# EAGLE design highwind_beaglebone_cape_v2 (EAGLE 5.12)
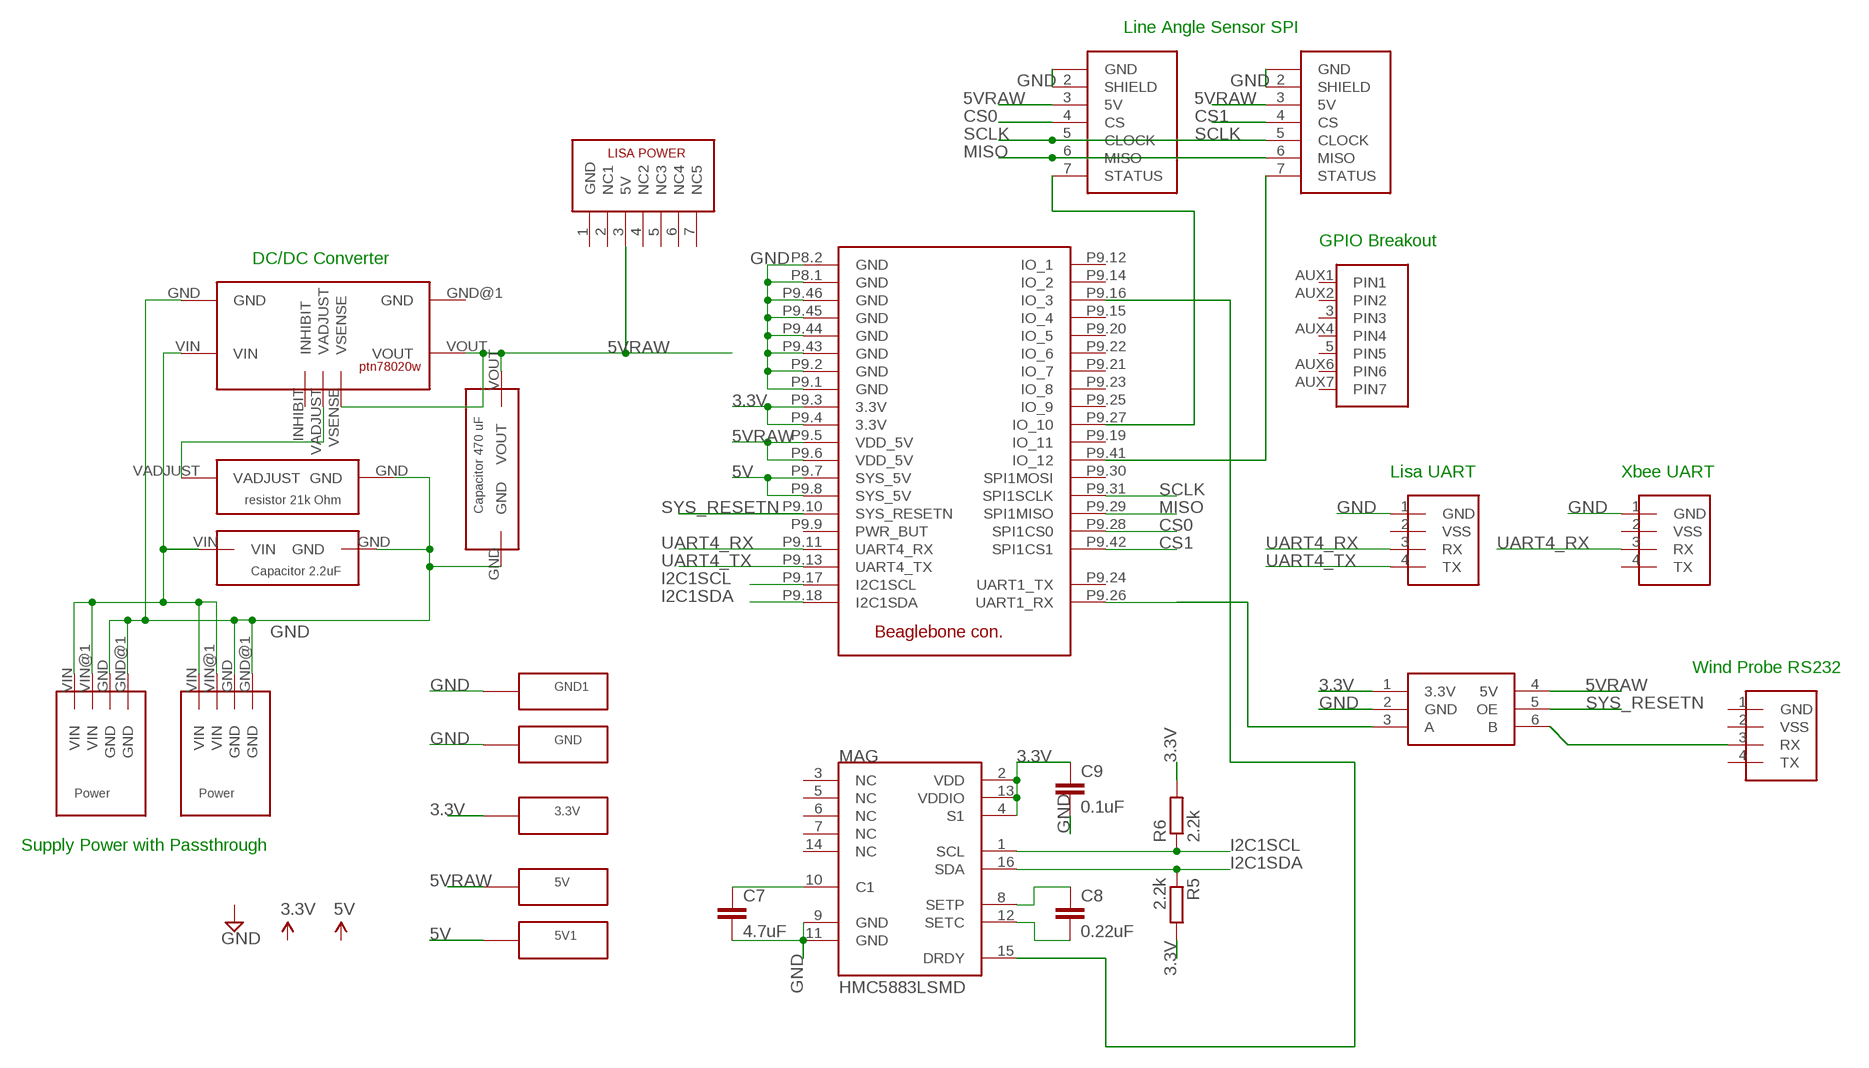
[diagram p0: schematic, sheet 1]

## Parts
3.3V  1PIN  [1PIN]
5V  1PIN  [1PIN]
5V1  1PIN  [1PIN]
AZIMUTH_ENCODER  LINEANGLE_SPI  [53047-07-STANDARD]
C7  4.7uF  C-EUC0805  [C0805]
C8  0.22uF  C-EUC0805  [C0805]
C9  0.1uF  C-EUC0805  [C0805]
DC-DC_CONVERTER  PTN78020W  [PTN78020W]
ELEVATION_ENCODER  LINEANGLE_SPI  [53047-07-STANDARD]
FOR_FUTURE_USE  HIGHWIND_GPIO  [53047-07-BREAKOUT]
GND  1PIN  [1PIN]
GND1  1PIN  [1PIN]
LEVEL_SHIFTER  TXS0101  [SOT23-6]
LISA_POWER  LISA_POWER  [53047-07-STANDARD]
LISA_UART  PICO4UART  [53047-04-STANDARD]
MAG  HMC5883LSMD  [16LPCC]
R5  2.2k  R-EU_R0805  [R0805]
R6  2.2k  R-EU_R0805  [R0805]
U$1  BEAGLEBONECONNECTOR  [BBONE_SHIELD_HEADER]
U$2  2.2F  [2.2?F]
U$4  21KOHM  [21KOHM]
U$5  470F  [470?F]
U$11  4PINPOWER  [4PINPOWER]
U$14  4PINPOWER  [4PINPOWER]
WIND  PICO4UART  [53047-04-STANDARD]
XBEE_UART  PICO4UART  [53047-04-STANDARD]

## Nets
3.3V: 3.3V.1(PINOUT) C9.1 LEVEL_SHIFTER.1(3.3V) MAG.2(VDD) MAG.4(S1) MAG.13(VDDIO) R5.2 R6.2 U$1.P9.3(3.3V) U$1.P9.4(3.3V)
5V: 5V1.1(PINOUT) U$1.P9.7(SYS_5V) U$1.P9.8(SYS_5V)
5VRAW: 5V.1(PINOUT) AZIMUTH_ENCODER.3(5V) DC-DC_CONVERTER.VOUT DC-DC_CONVERTER.VSENSE ELEVATION_ENCODER.3(5V) LEVEL_SHIFTER.4(5V) LISA_POWER.3(5V) U$1.P9.5(VDD_5V) U$1.P9.6(VDD_5V) U$5.VOUT
CS0: AZIMUTH_ENCODER.4(CS) U$1.P9.28(SPI1CS0)
CS1: ELEVATION_ENCODER.4(CS) U$1.P9.42(SPI1CS1)
GND: AZIMUTH_ENCODER.1(GND) AZIMUTH_ENCODER.2(SHIELD) C7.2 C9.2 DC-DC_CONVERTER.GND ELEVATION_ENCODER.1(GND) ELEVATION_ENCODER.2(SHIELD) GND1.1(PINOUT) GND.1(PINOUT) LEVEL_SHIFTER.2(GND) LISA_UART.1(GND) MAG.9(GND) MAG.11(GND) U$1.P8.1(GND) U$1.P8.2(GND) U$1.P9.1(GND) U$1.P9.2(GND) U$1.P9.43(GND) U$1.P9.44(GND) U$1.P9.45(GND) U$1.P9.46(GND) U$2.GND U$4.GND U$5.GND U$11.GND U$11.GND@1(GND) U$14.GND U$14.GND@1(GND) XBEE_UART.1(GND)
I2C1SCL: MAG.1(SCL) R6.1 U$1.P9.17(I2C1SCL)
I2C1SDA: MAG.16(SDA) R5.1 U$1.P9.18(I2C1SDA)
MISO: AZIMUTH_ENCODER.6(MISO) ELEVATION_ENCODER.6(MISO) U$1.P9.29(SPI1MISO)
N$1: LEVEL_SHIFTER.6(B) WIND.3(RX)
N$2: MAG.15(DRDY) U$1.P9.16(IO_3)
N$5: ELEVATION_ENCODER.7(STATUS) U$1.P9.41(IO_12)
N$6: AZIMUTH_ENCODER.7(STATUS) U$1.P9.27(IO_10)
N$13: C7.1 MAG.10(C1)
N$14: C8.1 MAG.8(SETP)
N$15: C8.2 MAG.12(SETC)
SCLK: AZIMUTH_ENCODER.5(CLOCK) ELEVATION_ENCODER.5(CLOCK) U$1.P9.31(SPI1SCLK)
SYS_RESETN: LEVEL_SHIFTER.5(OE) U$1.P9.10(SYS_RESETN)
UART1_RX: LEVEL_SHIFTER.3(A) U$1.P9.26(UART1_RX)
UART4_RX: LISA_UART.3(RX) U$1.P9.11(UART4_RX) XBEE_UART.3(RX)
UART4_TX: LISA_UART.4(TX) U$1.P9.13(UART4_TX)
VADJUST: DC-DC_CONVERTER.VADJUST U$4.VADJUST
VIN: DC-DC_CONVERTER.VIN U$2.VIN U$11.VIN U$11.VIN@1(VIN) U$14.VIN U$14.VIN@1(VIN)
Unconnected: FOR_FUTURE_USE.3(PIN3) FOR_FUTURE_USE.5(PIN5) FOR_FUTURE_USE.AUX1(PIN1) FOR_FUTURE_USE.AUX2(PIN2) FOR_FUTURE_USE.AUX4(PIN4) FOR_FUTURE_USE.AUX6(PIN6) FOR_FUTURE_USE.AUX7(PIN7) LISA_POWER.2(NC1) LISA_POWER.4(NC2) LISA_POWER.5(NC3) LISA_POWER.6(NC4) LISA_POWER.7(NC5) LISA_UART.2(VSS) MAG.3(NC) MAG.5(NC) MAG.6(NC) MAG.7(NC) MAG.14(NC) U$1.P9.9(PWR_BUT) U$1.P9.12(IO_1) U$1.P9.14(IO_2) U$1.P9.15(IO_4) U$1.P9.19(IO_11) U$1.P9.20(IO_5) U$1.P9.21(IO_7) U$1.P9.22(IO_6) U$1.P9.23(IO_8) U$1.P9.24(UART1_TX) U$1.P9.25(IO_9) U$1.P9.30(SPI1MOSI) WIND.2(VSS) WIND.4(TX) XBEE_UART.2(VSS) XBEE_UART.4(TX)

## Notes on the sheet
- Line Angle Sensor SPI
- GPIO Breakout
- DC/DC Converter
- Lisa UART | Xbee UART
- Wind Probe RS232
- Supply Power with Passthrough

## Power pins joined to a net without a drawn wire
GND: DC-DC_CONVERTER.GND@1(GND) LISA_POWER.1(GND) WIND.1(GND)
INHIBIT: DC-DC_CONVERTER.INHIBIT

## Library data of the parts
3.3V 5V 5V1 GND GND1 = Highwind:1PIN
AZIMUTH_ENCODER ELEVATION_ENCODER = Highwind:LINEANGLE_SPI
C7-C9 = resistor:C-EU: CAPACITOR, European symbol
DC-DC_CONVERTER = Highwind:PTN78020W
FOR_FUTURE_USE = Highwind:HIGHWIND_GPIO
LEVEL_SHIFTER = Highwind:TXS0101
LISA_POWER = Highwind:LISA_POWER
LISA_UART WIND XBEE_UART = Highwind:PICO4UART
MAG = SparkFun:HMC5883L: 3 Axis Digital Compass IC
R5 R6 = resistor:R-EU_: RESISTOR, European symbol
U$1 = Highwind:BEAGLEBONECONNECTOR
U$2 = Highwind:2.2?F
U$4 = Highwind:21KOHM
U$5 = Highwind:470?F
U$11 U$14 = Highwind:4PINPOWER

## Board
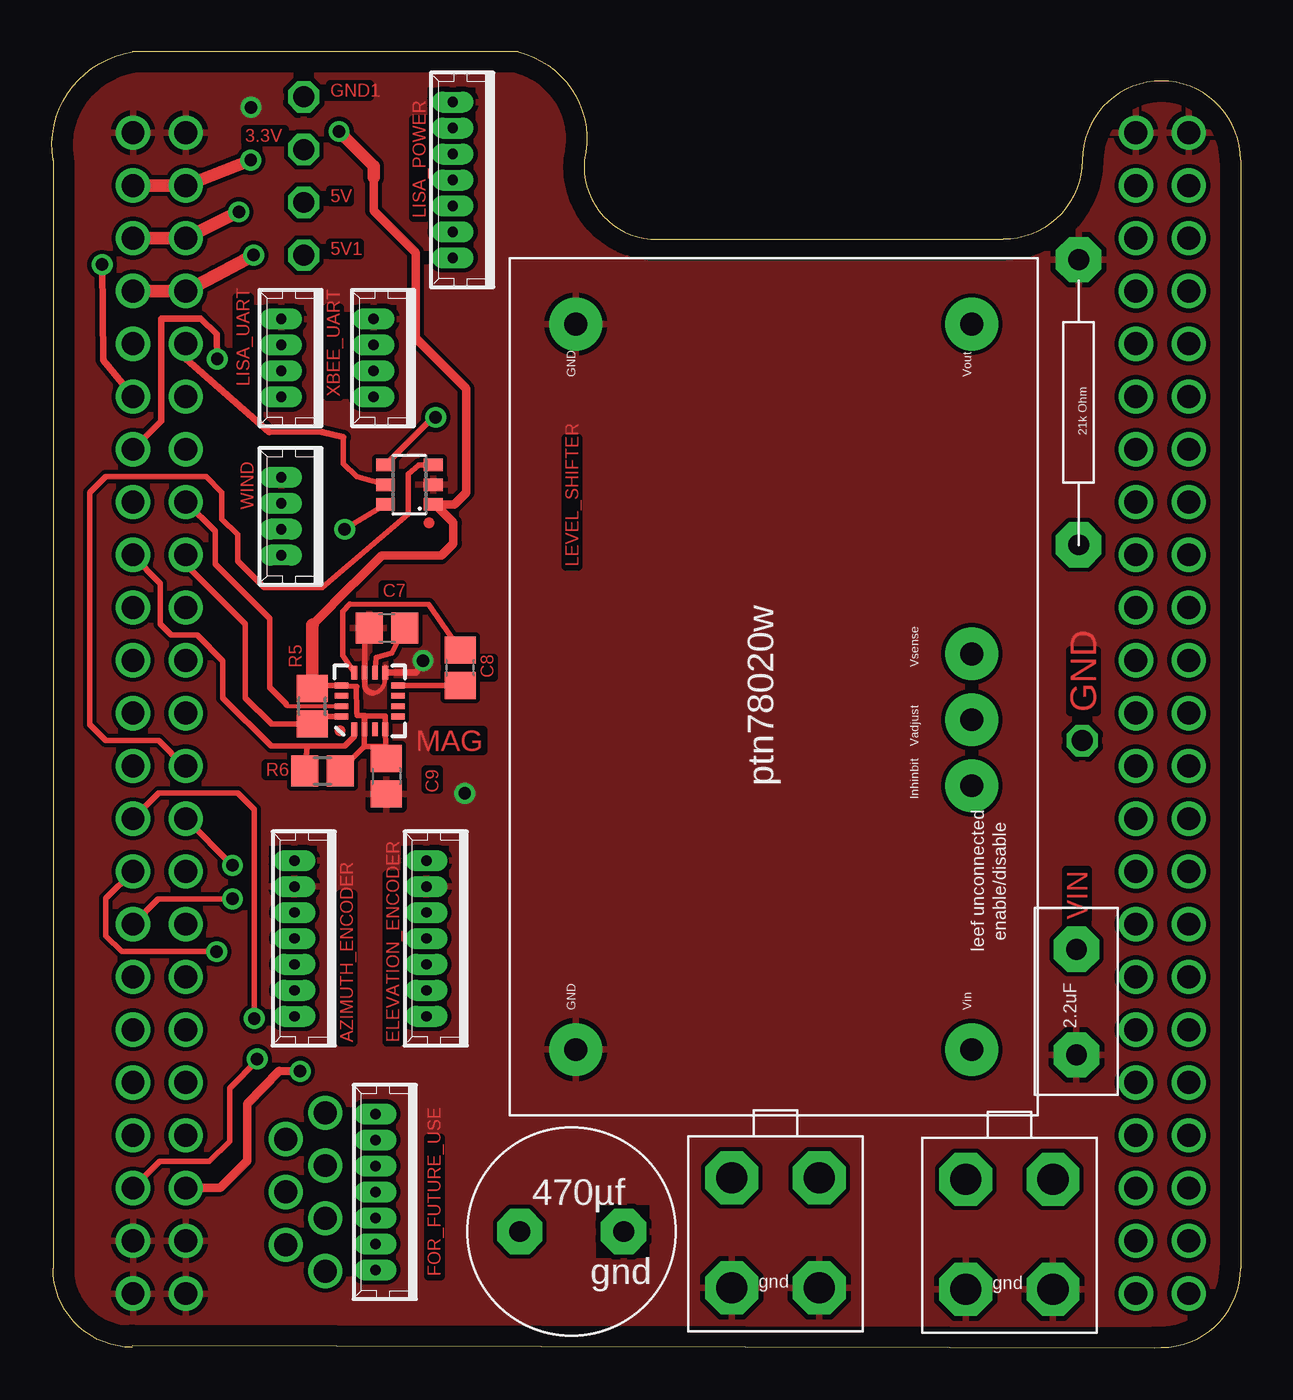
[diagram p1: board, top side]
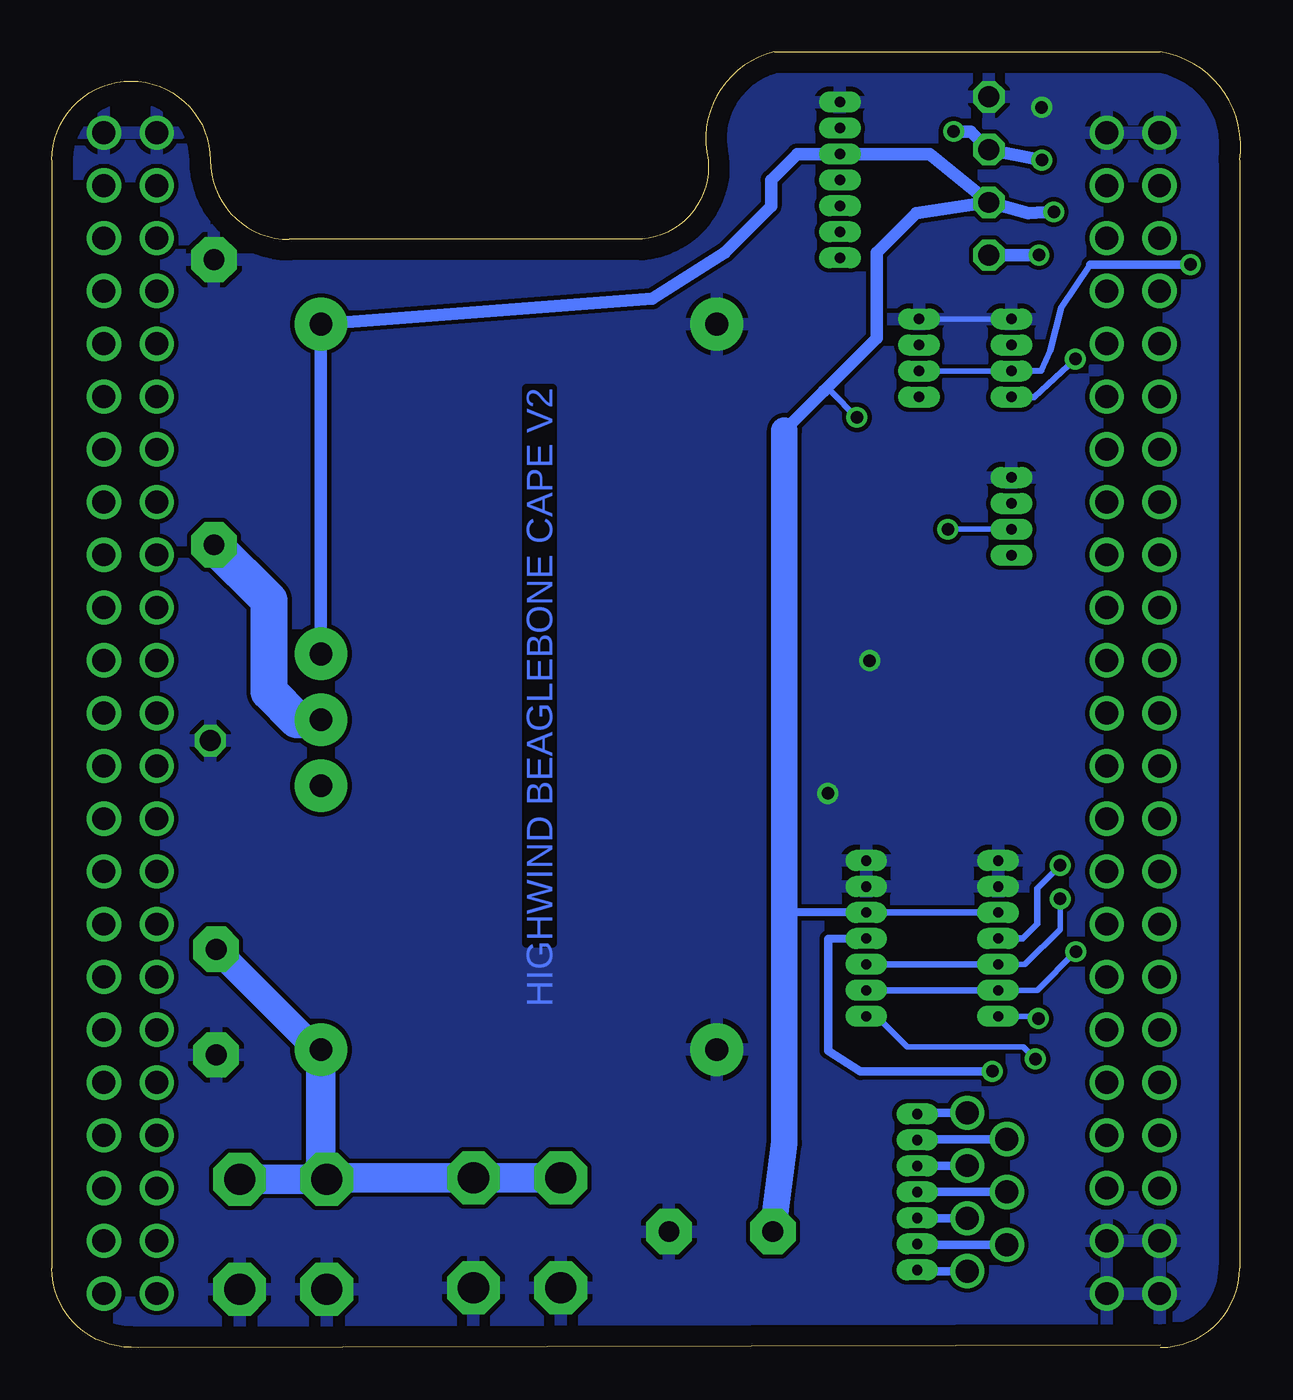
[diagram p2: board, bottom side, seen from below]

Size 57.2 x 62.37 mm. Coordinates in mm from the lower left corner, seen from the top.
Outline: 3.86,0.01 arc-90 0.05,3.82 0.05,57.16 arc-90 3.86,62.37 22.44,62.37 arc-90 25.62,57.16 arc90 28.81,53.35 45.77,53.35 arc90 49.58,57.16 arc-90 53.39,60.97 arc-90 57.2,57.16 57.2,3.82 arc-90 53.39,0.01 53.05,0 3.86,0.1
Copper layers (1*16): Top 0.035mm / dielectric 1.5mm / Bottom 0.035mm
Design rules "esat": minimum track width 10mil, minimum drill 24mil, track to track 8mil, track to pad 8mil, pad to pad 8mil, via to via 8mil, smd to smd 8mil, copper to edge 40mil, drill to drill 8mil, minimum pad ring 10mil, minimum via ring 8mil, stop-mask expansion 4mil, vias tented up to drill 0mil, thermal gap 10mil

### Footprints (pad centres in the part's own frame; a part is rotated, then mirrored left to right if it is on the bottom)
1PIN = drill 1 octagon: 1 0,0
53047-07-STANDARD = drill 0.5 pad 0.698 long: 1 3.75,0.45; 2 2.5,0.45; 3 1.25,0.45; 4 0,0.45; 5 -1.25,0.45; 6 -2.5,0.45; 7 -3.75,0.45
C0805 = smd 1.3 x 1.5: 1 -0.85,0; 2 0.85,0
PTN78020W = drill 1.1 pad 2.54 round: GND -15.875,19.05; GND@1 19.05,19.05; INHIBIT -3.175,0; VADJUST 0,0; VIN -15.875,0; VOUT 19.05,0; VSENSE 3.175,0
53047-07-BREAKOUT = drill 0.5 pad 0.698 long: 1 3.75,0.45; 2 2.5,0.45; 3 1.25,0.45; 4 0,0.45; 5 -1.25,0.45; 6 -2.5,0.45; 7 -3.75,0.45 | drill 1.1 round: AUX1 3.81,2.857; AUX2 2.54,4.763; AUX3 1.27,2.857; AUX4 0,4.763; AUX5 -1.27,2.857; AUX6 -2.54,4.763; AUX7 -3.81,2.857
SOT23-6 = smd 0.6 x 0.9: 1 -0.95,-1.15; 2 0,-1.15; 3 0.95,-1.15; 4 0.95,1.15; 5 0,1.15; 6 -0.95,1.15
53047-04-STANDARD = drill 0.5 pad 0.698 long: 1 1.875,0.45; 2 0.625,0.45; 3 -0.625,0.45; 4 -1.875,0.45
16LPCC = smd 0.65 x 0.28: 1 -1.37,0.75; 2 -1.37,0.25; 3 -1.37,-0.25; 4 -1.37,-0.75; 9 1.37,-0.75; 10 1.37,-0.25; 11 1.37,0.25; 12 1.37,0.75 | smd 0.28 x 0.65: 5 -0.75,-1.37; 6 -0.25,-1.37; 7 0.25,-1.37; 8 0.75,-1.37; 13 0.75,1.37; 14 0.25,1.37; 15 -0.25,1.37; 16 -0.75,1.37
R0805 = smd 1.3 x 1.5: 1 -0.85,0; 2 0.85,0
BBONE_SHIELD_HEADER = drill 1.1 round: P8.1 20.32,25.4; P8.2 22.86,25.4; P8.3 20.32,22.86; P8.4 22.86,22.86; P8.5 20.32,20.32; P8.6 22.86,20.32; P8.7 20.32,17.78; P8.8 22.86,17.78; P8.9 20.32,15.24; P8.10 22.86,15.24; P8.11 20.32,12.7; P8.12 22.86,12.7; P8.13 20.32,10.16; P8.14 22.86,10.16; P8.15 20.32,7.62; P8.16 22.86,7.62; P8.17 20.32,5.08; P8.18 22.86,5.08; P8.19 20.32,2.54; P8.20 22.86,2.54; P8.21 20.32,0; P8.22 22.86,0; P8.23 20.32,-2.54; P8.24 22.86,-2.54; P8.25 20.32,-5.08; P8.26 22.86,-5.08; P8.27 20.32,-7.62; P8.28 22.86,-7.62; P8.29 20.32,-10.16; P8.30 22.86,-10.16; P8.31 20.32,-12.7; P8.32 22.86,-12.7; P8.33 20.32,-15.24; P8.34 22.86,-15.24; P8.35 20.32,-17.78; P8.36 22.86,-17.78; P8.37 20.32,-20.32; P8.38 22.86,-20.32; P8.39 20.32,-22.86; P8.40 22.86,-22.86; P8.41 20.32,-25.4; P8.42 22.86,-25.4; P8.43 20.32,-27.94; P8.44 22.86,-27.94; P8.45 20.32,-30.48; P8.46 22.86,-30.48; P9.1 -27.94,25.4; P9.2 -25.4,25.4; P9.3 -27.94,22.86; P9.4 -25.4,22.86; P9.5 -27.94,20.32; P9.6 -25.4,20.32; P9.7 -27.94,17.78; P9.8 -25.4,17.78; P9.9 -27.94,15.24; P9.10 -25.4,15.24; P9.11 -27.94,12.7; P9.12 -25.4,12.7; P9.13 -27.94,10.16; P9.14 -25.4,10.16; P9.15 -27.94,7.62; P9.16 -25.4,7.62; P9.17 -27.94,5.08; P9.18 -25.4,5.08; P9.19 -27.94,2.54; P9.20 -25.4,2.54; P9.21 -27.94,0; P9.22 -25.4,0; P9.23 -27.94,-2.54; P9.24 -25.4,-2.54; P9.25 -27.94,-5.08; P9.26 -25.4,-5.08; P9.27 -27.94,-7.62; P9.28 -25.4,-7.62; P9.29 -27.94,-10.16; P9.30 -25.4,-10.16; P9.31 -27.94,-12.7; P9.32 -25.4,-12.7; P9.33 -27.94,-15.24; P9.34 -25.4,-15.24; P9.35 -27.94,-17.78; P9.36 -25.4,-17.78; P9.37 -27.94,-20.32; P9.38 -25.4,-20.32; P9.39 -27.94,-22.86; P9.40 -25.4,-22.86; P9.41 -27.94,-25.4; P9.42 -25.4,-25.4; P9.43 -27.94,-27.94; P9.44 -25.4,-27.94; P9.45 -27.94,-30.48; P9.46 -25.4,-30.48
2.2?F = drill 1 pad 2.184 octagon: GND -5.08,0; VIN 0,0
21KOHM = drill 1 pad 2.184 octagon: GND -13.73,0; VADJUST 0,0
470?F = drill 1 pad 2.184 octagon: GND -5,0; VOUT 0,0
4PINPOWER = drill 1.5 pad 2.54 octagon: GND 0,0; GND@1 4.2,0; VIN 0,5.3; VIN@1 4.2,5.3

### Placement (x,y rotation side)
3.3V  12.12,57.67 0 top
5V  12.12,55.13 0 top
5V1  12.12,52.59 0 top
AZIMUTH_ENCODER  12.12,19.7 90 top
C7  16.13,34.63 180 top
C8  19.65,32.73 90 top
C9  16.09,27.51 270 top
DC-DC_CONVERTER  44.26,30.22 90 top
ELEVATION_ENCODER  18.47,19.7 90 top
FOR_FUTURE_USE  16.01,7.49 90 top
GND  49.58,29.22 90 top
GND1  12.12,60.21 0 top
LEVEL_SHIFTER  17.2,41.54 90 top
LISA_POWER  19.74,56.21 90 top
LISA_UART  11.48,47.63 90 top
MAG  15.29,31.12 90 top
R5  12.52,30.87 90 top
R6  13.02,27.76 0 top
U$1  31.84,33.08 0 top
U$2  49.3,19.17 90 top
U$4  49.41,38.64 270 top
U$5  22.51,5.58 180 top
U$11  43.97,2.8 0 top
U$14  32.72,2.88 0 top
WIND  11.48,40.02 90 top
XBEE_UART  15.93,47.63 90 top

### Tracks (layer width: path | path; a pad name or v marks a point on that pad's centre or on a via)
3.3V  (via drill 0.6)
  Top 0.254: 16.07,28.92 MAG.4 16.03,30.41 15.03,30.41 MAG.2 15.04,30.42 14.68,30.42 14.66,30.58 14.63,31.83 14.67,31.83 MAG.13 12.68,31.88 R5.2 | 16.07,28.92 C9.1 | R6.2 15.04,28.93 16.07,28.93 16.07,28.92
  Top 0.406: 15.48,56.34 15.48,54.73 17.5,52.71 17.5,48.59 19.94,46.16 19.94,41.16 19.35,40.58 18.44,40.58 | LEVEL_SHIFTER.1 18.36,40.58 18.44,40.58 | 18.44,40.58 19.31,39.7 19.31,38.7 18.73,38.12 15.88,38.12 14.52,36.77 14.5,36.77 12.54,34.81 | R5.2 12.54,31.74
  Top 0.61: U$1.P9.3 U$1.P9.4 v9.57,57.16 | v13.81,58.54 15.48,56.88 15.48,56.34 | 12.54,34.81 12.52,34.79 R5.2
  Bottom 0.61: v9.57,57.16 3.3V.1 12.99,58.54 v13.81,58.54
5V  (via drill 0.6)
  Top 0.61: U$1.P9.7 U$1.P9.8 7.89,51.63 v9.7,52.59
  Bottom 0.61: v9.7,52.59 5V1.1
5VRAW  (via drill 0.6)
  Top 0.254: LEVEL_SHIFTER.4 18.34,44.78 v18.47,44.78
  Top 0.61: U$1.P9.5 U$1.P9.6 v8.99,54.67
  Bottom 0.254: v18.47,44.78 19.74,46.05 20.05,46.05
  Bottom 0.305: ELEVATION_ENCODER.3 AZIMUTH_ENCODER.3
  Bottom 0.406: 21.96,20.97 ELEVATION_ENCODER.3
  Bottom 0.61: 5V.1 14.95,57.46 LISA_POWER.3 21.34,57.46 22.59,56.21 22.59,54.94 24.82,52.71 28.31,50.49 DC-DC_CONVERTER.VOUT DC-DC_CONVERTER.VSENSE | 5V.1 10.21,54.62 v8.99,54.67 | 5V.1 15.61,54.62 17.51,52.71 17.51,48.59 20.05,46.05 21.96,44.14
  Bottom 1.27: 21.96,44.14 21.96,20.97 21.96,9.85 U$5.VOUT
CS0  (via drill 0.6)
  Top 0.254: v8.69,23.21 U$1.P9.28
  Bottom 0.305: v8.69,23.21 9.8,22.11 9.8,20.4 10.5,19.7 AZIMUTH_ENCODER.4
CS1  (via drill 0.6)
  Top 0.406: U$1.P9.42 8.1,7.7 9.4,9 9.39,11.72 10.93,13.31 v11.95,13.3
  Bottom 0.406: ELEVATION_ENCODER.4 19.85,19.68 19.85,14.28 18.29,13.29 v11.95,13.3
GND  (via drill 0.6)
  Top 0.19: 15.47,31.51 arc90 16.02,32.23
  Top 0.254: C7.2 15.16,34.66 15.06,34.58 MAG.11 15.04,31.93 arc90 15.47,31.51 | 16.04,32.73 MAG.9 16.02,32.23
  Top 0.305: v17.86,33.07 17.54,32.49 MAG.9
  Bottom 0.254: LISA_UART.1 XBEE_UART.1
  other vias: 9.58,59.7 19.86,26.68
  pour Bottom: -0.95,64.5 -2.15,-2.18 59.23,-1.77 59.97,64.5
  pour Top: 2.59,6.36 2.59,1.28 8.43,1.28 8.43,6.36
  pour Top: -2.49,64.78 -3.12,-3.8 61.01,-3.8 61.01,67.32 -2.49,67.32
I2C1SCL
  Top 0.254: MAG.1 14.54,29.41 14.1,28.97 12.32,28.97 | 12.32,28.97 10.54,28.97 8.23,31.28 8.23,33.05 6.99,34.3 5.74,34.3 5.21,34.83 5.21,36.79 3.9,38.09 U$1.P9.17 | R6.1 12.28,28.93 12.32,28.97
I2C1SDA
  Top 0.254: MAG.16 13.91,30.39 13.03,30.39 12.66,30.02 R5.1 10.55,30.02 10.54,30.03 9.3,31.28 9.3,34.83 6.44,37.69 U$1.P9.18
MISO  (via drill 0.6)
  Top 0.254: U$1.P9.29 2.59,21.61 2.59,19.82 3.35,19.06 v7.93,19.06
  Bottom 0.254: v7.93,19.06 9.79,17.2 AZIMUTH_ENCODER.6
  Bottom 0.305: AZIMUTH_ENCODER.6 ELEVATION_ENCODER.6
N$1  (via drill 0.6)
  Top 0.254: v14.09,39.39 LEVEL_SHIFTER.6
  Bottom 0.254: WIND.3 v14.09,39.39
N$2
  Top 0.19: 11.27,30.93 11.32,30.88 MAG.15
  Top 0.254: U$1.P9.16 7.85,39.29 7.85,37.72 10.47,35.1 10.47,31.78 11.27,30.98 11.27,30.93
N$4
  Top 0.254: 15.04,28.9 15.04,29.72
N$5  (via drill 0.6)
  Top 0.254: U$1.P9.41 5.18,8.96 7.57,8.96 8.55,9.93 8.55,12.49 9.88,13.82 v9.88,13.89
  Bottom 0.254: v9.88,13.89 10.45,14.47 16.03,14.47 17.51,15.95 ELEVATION_ENCODER.7
N$6  (via drill 0.6)
  Top 0.254: U$1.P9.27 5.15,26.71 8.94,26.71 9.73,25.91 v9.73,15.84
  Bottom 0.254: v9.73,15.84 9.84,15.95 AZIMUTH_ENCODER.7
N$13
  Top 0.254: C7.1 16.36,33.44 15.6,33.21 MAG.10
N$14
  Top 0.254: C8.1 17.78,31.86 MAG.8
N$15
  Top 0.254: C8.2 18.14,35.77 14.34,35.79 13.99,35.44 14,33.31 MAG.12
SCLK  (via drill 0.6)
  Top 0.254: U$1.P9.31 5.12,21.6 v8.69,21.6
  Bottom 0.254: AZIMUTH_ENCODER.5 10.38,18.45 8.69,20.14 v8.69,21.6
  Bottom 0.305: AZIMUTH_ENCODER.5 ELEVATION_ENCODER.5
SYS_RESETN
  Top 0.254: 10.47,44.08 13.01,44.08 | 14.02,43.83 14.02,42.55 14.66,41.92 LEVEL_SHIFTER.5
  Top 0.305: U$1.P9.10 6.44,47.6 10.47,44.08 | 13.01,44.08 14.02,43.83
UART1_RX
  Top 0.254: U$1.P9.26 6.35,28 5.13,29.22 2.59,29.22 1.83,29.98 1.83,41.16 2.59,41.92 7.42,41.92 8.18,41.16 8.18,39.89 8.94,39.13 8.94,37.86 10.21,36.59 13.01,36.59 17.13,40.11 17.13,42.04 17.64,42.49 LEVEL_SHIFTER.3
UART4_RX  (via drill 0.6)
  Top 0.305: U$1.P9.11 2.46,47.54 v2.41,52.13
  Bottom 0.254: LISA_UART.3 XBEE_UART.3
  Bottom 0.305: 7.24,52.13 8.64,50.05 9.17,47.99 9.59,47.03 LISA_UART.3
  Bottom 0.406: v2.41,52.13 7.24,52.13
UART4_TX  (via drill 0.6)
  Top 0.305: U$1.P9.13 5.26,44.6 5.26,49.54 7.16,49.54 7.93,48.78 7.93,48.71 v7.95,47.59
  Bottom 0.305: v7.95,47.59 9.93,45.76 LISA_UART.4
VADJUST
  Bottom 1.778: DC-DC_CONVERTER.VADJUST 45.41,30.22 46.75,31.56 46.75,35.98 U$4.VADJUST
VIN
  Bottom 1.27: DC-DC_CONVERTER.VIN 44.47,14.34 U$2.VIN
  Bottom 1.422: 32.72,8.06 U$14.VIN U$14.VIN@1 43.97,8.18 U$11.VIN | U$11.VIN U$11.VIN@1 | U$11.VIN 44.26,8.11 DC-DC_CONVERTER.VIN
(copper drawn outside any net)
  shapes: Top circle x2

### Text on the board
Top: VIN
Bottom: HIGHWIND BEAGLEBONE CAPE V2
tNames: leef unconnected | enable/disable